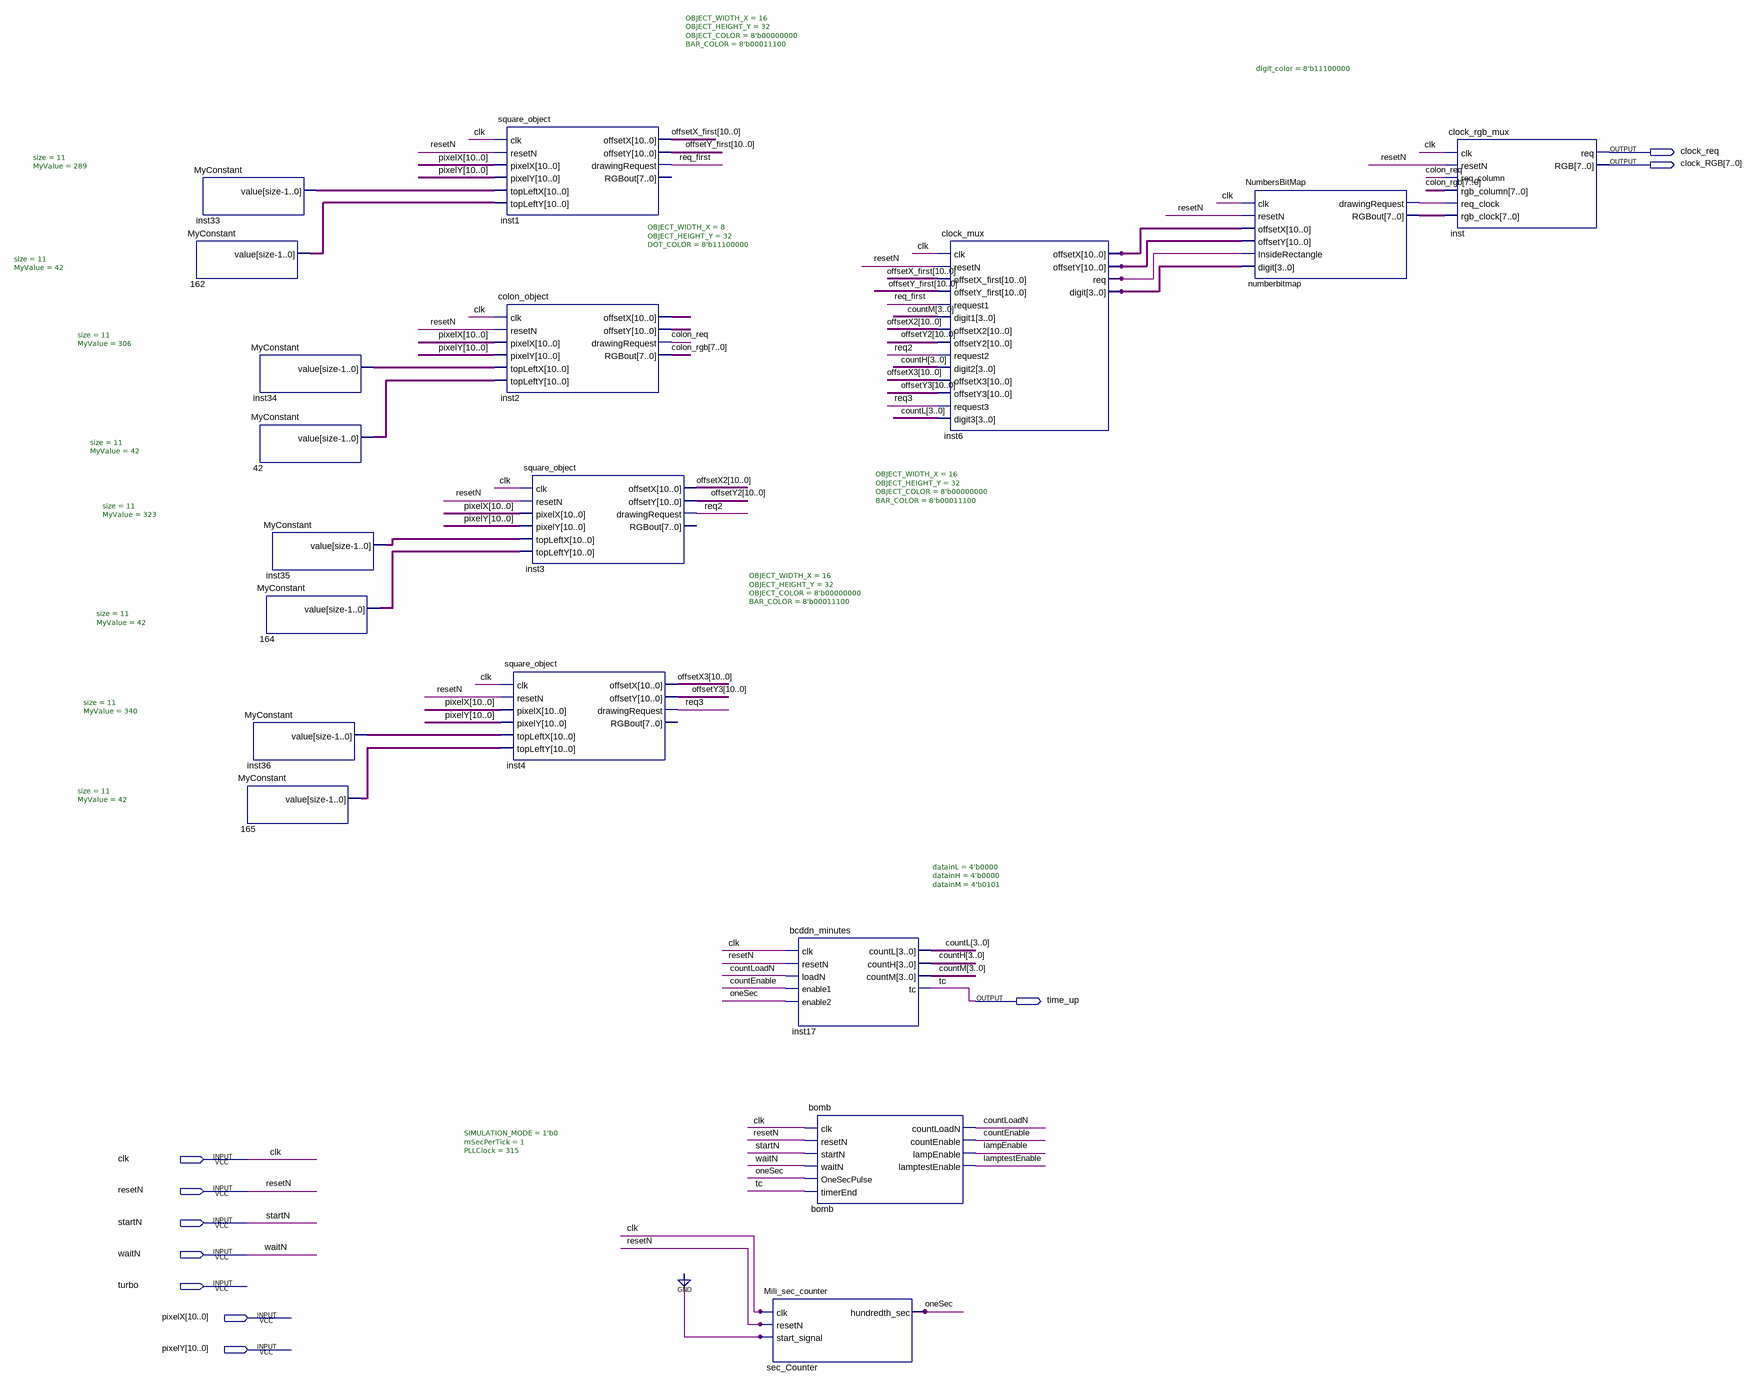
[diagram p0: schematic sheet]
// Quartus schematic clock_top.bdf as structural Verilog: 18 symbols, 10 pins
module clock_top (
  input  clk,
  input  resetN,
  input  startN,
  input  waitN,
  input  turbo,
  input  [10:0] pixelX,
  input  [10:0] pixelY,
  output clock_req,
  output [7:0] clock_RGB,
  output time_up
);

  wire colon_req, countEnable, countLoadN, inst6_req, lampEnable, lamptestEnable,
       numberbitmap_drawingrequest, oneSec, req2, req3, req_first;
  wire [3:0] countH, countL, countM, inst6_digit;
  wire [7:0] colon_rgb, numberbitmap_rgbout;
  wire [10:0] inst2_offsetx, inst2_offsety, inst6_offsetx, inst6_offsety, inst33_value, inst34_value,
       inst35_value, inst36_value, n42_value, n162_value, n164_value, n165_value, offsetX2, offsetX3,
       offsetX_first, offsetY2, offsetY3, offsetY_first;

  MyConstant #(.size(11), .MyValue(289)) inst33 (.value(inst33_value));
  MyConstant #(.size(11), .MyValue(42)) u_162 (.value(n162_value));
  MyConstant #(.size(11), .MyValue(340)) inst36 (.value(inst36_value));
  MyConstant #(.size(11), .MyValue(42)) u_165 (.value(n165_value));
  MyConstant #(.size(11), .MyValue(306)) inst34 (.value(inst34_value));
  MyConstant #(.size(11), .MyValue(42)) u_42 (.value(n42_value));
  MyConstant #(.size(11), .MyValue(323)) inst35 (.value(inst35_value));
  MyConstant #(.size(11), .MyValue(42)) u_164 (.value(n164_value));
  square_object #(.OBJECT_WIDTH_X(16), .OBJECT_HEIGHT_Y(32), .OBJECT_COLOR(8'b00000000), .BAR_COLOR(8'b00011100)) inst1 (
    .clk(clk), .resetN(resetN), .pixelX(pixelX), .pixelY(pixelY), .topLeftX(inst33_value),
    .topLeftY(n162_value), .offsetX(offsetX_first), .offsetY(offsetY_first), .drawingRequest(req_first));  // open: RGBout
  colon_object #(.OBJECT_WIDTH_X(8), .OBJECT_HEIGHT_Y(32), .DOT_COLOR(8'b11100000)) inst2 (
    .clk(clk), .resetN(resetN), .pixelX(pixelX), .pixelY(pixelY), .topLeftX(inst34_value),
    .topLeftY(n42_value), .offsetX(inst2_offsetx), .offsetY(inst2_offsety), .drawingRequest(colon_req),
    .RGBout(colon_rgb));
  square_object #(.OBJECT_WIDTH_X(16), .OBJECT_HEIGHT_Y(32), .OBJECT_COLOR(8'b00000000), .BAR_COLOR(8'b00011100)) inst3 (
    .clk(clk), .resetN(resetN), .pixelX(pixelX), .pixelY(pixelY), .topLeftX(inst35_value),
    .topLeftY(n164_value), .offsetX(offsetX2), .offsetY(offsetY2), .drawingRequest(req2));  // open: RGBout
  square_object #(.OBJECT_WIDTH_X(16), .OBJECT_HEIGHT_Y(32), .OBJECT_COLOR(8'b00000000), .BAR_COLOR(8'b00011100)) inst4 (
    .clk(clk), .resetN(resetN), .pixelX(pixelX), .pixelY(pixelY), .topLeftX(inst36_value),
    .topLeftY(n165_value), .offsetX(offsetX3), .offsetY(offsetY3), .drawingRequest(req3));  // open: RGBout
  bcddn_minutes #(.datainL(4'b0000), .datainH(4'b0000), .datainM(4'b0101)) inst17 (
    .clk(clk), .resetN(resetN), .loadN(countLoadN), .enable1(countEnable), .enable2(oneSec), .countL(countL),
    .countH(countH), .countM(countM), .tc(time_up));
  Mili_sec_counter #(.SIMULATION_MODE(1'b0), .mSecPerTick(1), .PLLClock(315)) sec_Counter (
    .clk(clk), .resetN(resetN), .start_signal(1'b0), .hundredth_sec(oneSec));
  bomb bomb (
    .clk(clk), .resetN(resetN), .startN(startN), .waitN(waitN), .OneSecPulse(oneSec), .timerEnd(time_up),
    .countLoadN(countLoadN), .countEnable(countEnable), .lampEnable(lampEnable),
    .lamptestEnable(lamptestEnable));
  clock_mux inst6 (
    .clk(clk), .resetN(resetN), .offsetX_first(offsetX_first), .offsetY_first(offsetY_first),
    .request1(req_first), .digit1(countM), .offsetX2(offsetX2), .offsetY2(offsetY2), .request2(req2),
    .digit2(countH), .offsetX3(offsetX3), .offsetY3(offsetY3), .request3(req3), .digit3(countL),
    .offsetX(inst6_offsetx), .offsetY(inst6_offsety), .req(inst6_req), .digit(inst6_digit));
  NumbersBitMap #(.digit_color(8'b11100000)) numberbitmap (
    .clk(clk), .resetN(resetN), .offsetX(inst6_offsetx), .offsetY(inst6_offsety),
    .InsideRectangle(inst6_req), .digit(inst6_digit), .drawingRequest(numberbitmap_drawingrequest),
    .RGBout(numberbitmap_rgbout));
  clock_rgb_mux inst (
    .clk(clk), .resetN(resetN), .req_column(colon_req), .rgb_column(colon_rgb),
    .req_clock(numberbitmap_drawingrequest), .rgb_clock(numberbitmap_rgbout), .req(clock_req), .RGB(clock_RGB));

  // Other names for the same wires on the sheet: tc = time_up
endmodule
